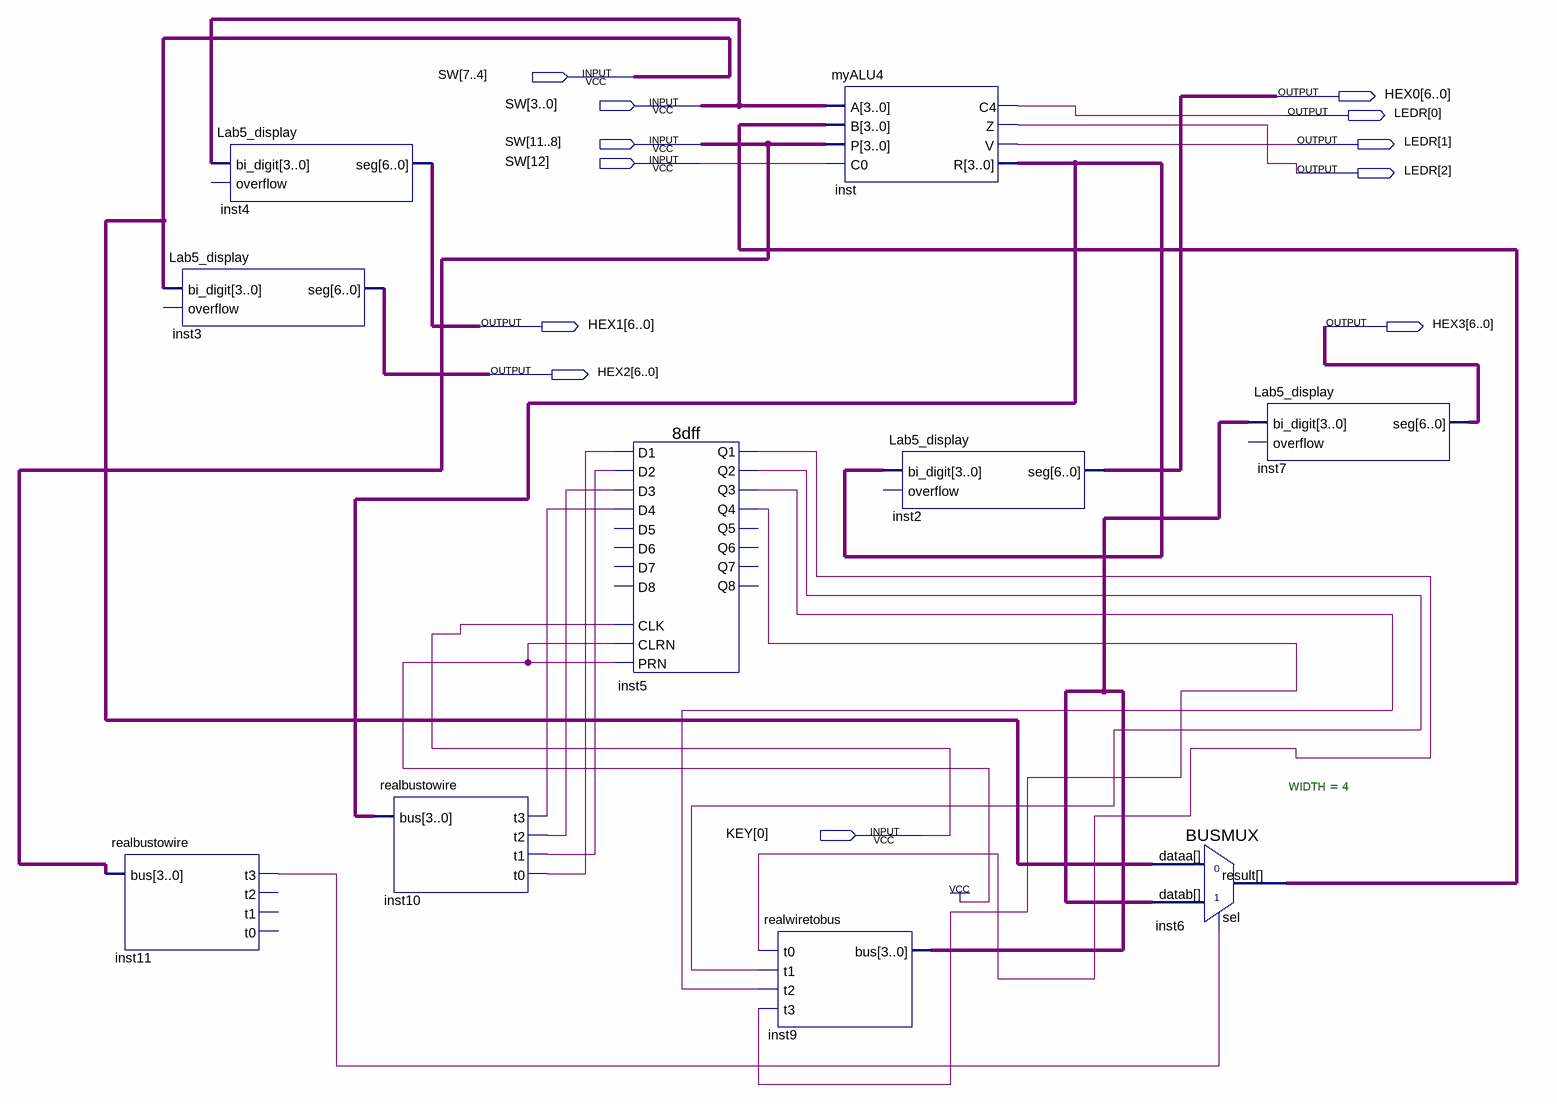
[diagram p0: schematic sheet]
// Quartus schematic lab6.bdf as structural Verilog: 10 symbols, 12 pins
module lab6 (
  input  [12:0] SW,
  input  [0:0] KEY,
  output [6:0] HEX0,
  output [2:0] LEDR,
  output [6:0] HEX1,
  output [6:0] HEX3,
  output [6:0] HEX2
);

  wire inst5_q1, inst5_q2, inst5_q3, inst5_q4, inst10_t0, inst10_t1, inst10_t2, inst10_t3, inst11_t3;
  wire [3:0] inst6_result, inst9_bus, inst_r;

  realbustowire inst11 (.bus(SW[11:8]), .t3(inst11_t3));  // open: t2, t1, t0
  Lab5_display inst4 (.bi_digit(SW[3:0]), .seg(HEX1));  // open: overflow
  Lab5_display inst3 (.bi_digit(SW[7:4]), .seg(HEX2));  // open: overflow
  realbustowire inst10 (.bus(inst_r), .t3(inst10_t3), .t2(inst10_t2), .t1(inst10_t1), .t0(inst10_t0));
  \8dff  inst5 (
    .D4(inst10_t3), .D3(inst10_t2), .PRN(1'b1), .CLK(KEY[0]), .CLRN(1'b1), .D2(inst10_t1), .D1(inst10_t0),
    .Q1(inst5_q1), .Q4(inst5_q4), .Q3(inst5_q3), .Q2(inst5_q2));  // open: D5, D8, D7, D6, Q8, Q5, Q6, Q7
  realwiretobus inst9 (.t0(inst5_q1), .t1(inst5_q2), .t2(inst5_q3), .t3(inst5_q4), .bus(inst9_bus));
  myALU4 inst (
    .A(SW[3:0]), .B(inst6_result), .P(SW[11:8]), .C0(SW[12]), .C4(LEDR[0]), .Z(LEDR[2]), .V(LEDR[1]),
    .R(inst_r));
  Lab5_display inst2 (.bi_digit(inst_r), .seg(HEX0));  // open: overflow
  BUSMUX #(.WIDTH(4)) inst6 (.datab(inst9_bus), .sel(inst11_t3), .dataa(SW[7:4]), .result(inst6_result));
  Lab5_display inst7 (.bi_digit(inst9_bus), .seg(HEX3));  // open: overflow
endmodule
